# Altium project Mircod_TEST.PrjPCB
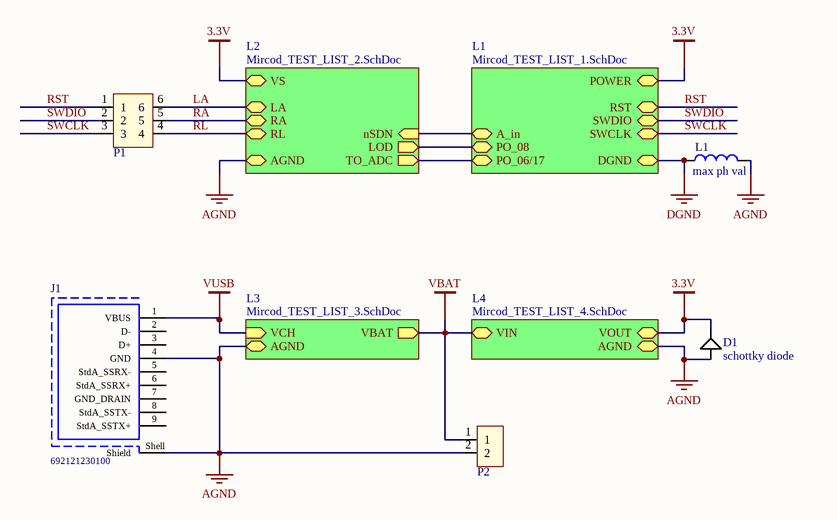
[diagram p0: Mircod_TEST_LIST_MAIN.SchDoc]
5 sheets, 47 parts. Net scope: hierarchical (ports join the sheet entries above them; power ports are global).
Board file: Mircod_TEST.PcbDoc
Sheets:
  Mircod_TEST_LIST_MAIN.SchDoc
    L2 = Mircod_TEST_LIST_2.SchDoc
    L3 = Mircod_TEST_LIST_3.SchDoc
    L1 = Mircod_TEST_LIST_1.SchDoc
    L4 = Mircod_TEST_LIST_4.SchDoc

## Sheet Mircod_TEST_LIST_MAIN.SchDoc
size A4

### Parts
D1  schottky diode  [DSMD_0603]
J1  692121230100  [692121230100]
L1  max ph val  [RDSMD_0603]
P1  PORT  [H_3X2_1_27]  (value not drawn)
P2  Header 1x2  [header-2]  (value not drawn)

### Sub-sheets
L1 = Mircod_TEST_LIST_1.SchDoc: RST, SWDIO, SWCLK, POWER, DGND, A_in, PO_08, PO_06/17
L2 = Mircod_TEST_LIST_2.SchDoc: RA, RL, LA, nSDN (in), LOD (out), TO_ADC (out), VS (bidir), AGND (bidir)
L3 = Mircod_TEST_LIST_3.SchDoc: VBAT (out), VCH (in), AGND
L4 = Mircod_TEST_LIST_4.SchDoc: VOUT, AGND, VIN

### Nets
3.3V: D1.2 ; sheet L2/VS, sheet L1/POWER, sheet L4/VOUT
AGND: D1.1 J1.4(GND) J1.Shell(Shield) L1.1 P2.2 ; sheet L2/AGND, sheet L3/AGND, sheet L4/AGND
DGND: L1.2 ; sheet L1/DGND
VBAT: P2.1 ; sheet L3/VBAT, sheet L4/VIN
VUSB: J1.1(VBUS) ; sheet L3/VCH
LA: P1.6 ; sheet L2/LA
RA: P1.5 ; sheet L2/RA
RL: P1.4 ; sheet L2/RL
RST: P1.1 ; sheet L1/RST
SWCLK: P1.3 ; sheet L1/SWCLK
SWDIO: P1.2 ; sheet L1/SWDIO
NetC7_1: sheet L2/TO_ADC, sheet L1/PO_06/17
NetU1_29: sheet L2/nSDN, sheet L1/A_in
NetU1_32: sheet L2/LOD, sheet L1/PO_08

Not connected (* = marked no-connect by the designer): J1 2(D-) 3(D+) 5(StdA_SSRX-) 6(StdA_SSRX+) 7(GND_DRAIN) 8(StdA_SSTX-) 9(StdA_SSTX+)

### Library data of the parts
D1 = DIODE
J1 = 692121230100: USB 3.0 Type A Receptacle WR-COM, Horizontal, THT, with Clips, with 1.04 mm Offset; Rated Current: 0.25 A; Contact Resistance: 50 mOhm; Working Voltage: 30 VAC; ComponentLink1Description: Manufacturer; ComponentLink1URL: http://www.we-online.de; ComponentLink2Description: Datasheet; ComponentLink2URL: https://katalog.we-online.de/em/datasheet/692121230100.pdf; Part Number: 692121230100; Published Date: September 2018; Publisher: Wurth Elektronik; Orientation: Horizontal; Connector Type: USB 3.0 Type A; Operating Temperature: -20 to 85 degC; Mounting Technology: THT; Gender: Receptacle; Packaging: Tape and Reel
L1 = INDUCTOR

## Sheet Mircod_TEST_LIST_2.SchDoc
size A4
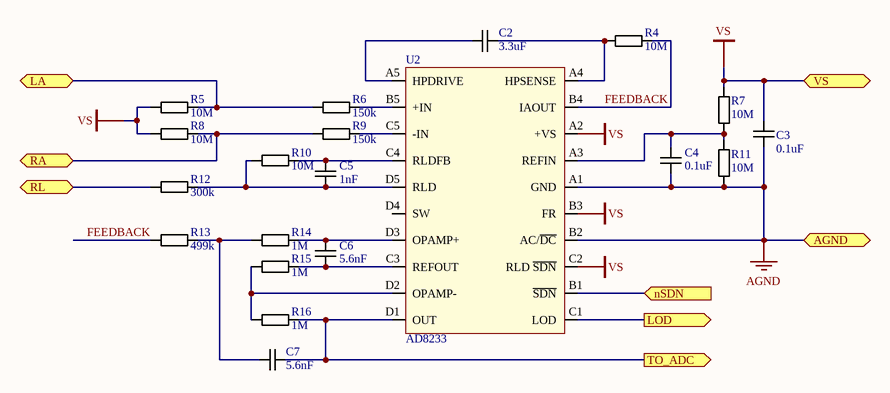
[diagram p1: Mircod_TEST_LIST_2.SchDoc]

### Parts
C2  3.3uF  [Csmd_0402]
C3  0.1uF  [Csmd_0402]
C4  0.1uF  [Csmd_0402]
C5  1nF  [Csmd_0402]
C6  5.6nF  [Csmd_0402]
C7  5.6nF  [Csmd_0402]
R4  10M  [SMD_0402]
R5  10M  [SMD_0402]
R6  150k  [SMD_0402]
R7  10M  [SMD_0402]
R8  10M  [SMD_0402]
R9  150k  [SMD_0402]
R10  10M  [SMD_0402]
R11  10M  [SMD_0402]
R12  300k  [SMD_0402]
R13  499k  [SMD_0402]
R14  1M  [SMD_0402]
R15  1M  [SMD_0402]
R16  1M  [SMD_0402]
U2  AD8233  [CB-20-13]

### Ports
AGND (bidir), LA, LOD (out), nSDN (in), RA, RL, TO_ADC (out), VS (bidir)

### Nets
AGND: C3.1 C4.1 R11.1 U2.A1(GND) U2.B2(AC/~{DC}) ; port AGND
VS: C3.2 R5.1 R7.2 R8.1 U2.A2(+VS) U2.B3(FR) U2.C2(RLD_~{SDN}) ; port VS  [project net 3.3V]
FEEDBACK: R4.2 R13.1 U2.B4(IAOUT)
LA: R5.2 R6.1 ; port LA
RA: R8.2 R9.1 ; port RA
RL: R12.1 ; port RL
NetC2_1: C2.1 U2.A5(HPDRIVE)
NetC2_2: C2.2 R4.1 U2.A4(HPSENSE)
NetC4_2: C4.2 R7.1 R11.2 U2.A3(REFIN)
NetC5_1: C5.1 R10.1 R12.2 U2.D5(RLD)
NetC5_2: C5.2 R10.2 U2.C4(RLDFB)
NetC6_1: C6.1 R15.2 U2.C3(REFOUT)
NetC6_2: C6.2 R14.2 U2.D3(OPAMP+)
NetC7_1: C7.1 R16.2 U2.D1(OUT) ; port TO_ADC
NetC7_2: C7.2 R13.2 R14.1
NetR6_2: R6.2 U2.B5(+IN)
NetR9_2: R9.2 U2.C5(-IN)
NetR15_1: R15.1 R16.1 U2.D2(OPAMP-)
NetU1_29: U2.B1(~{SDN}) ; port nSDN
NetU1_32: U2.C1(LOD) ; port LOD

Not connected (* = marked no-connect by the designer): U2 D4(SW)

### Library data of the parts
C2-C7 = C_SMD: CAPACITOR
R4-R16 = R_SMD: RESISTOR
U2 = AD8233: Low Noise,  Heart Rate Monitor for Wearable Products

## Sheet Mircod_TEST_LIST_3.SchDoc
size A4
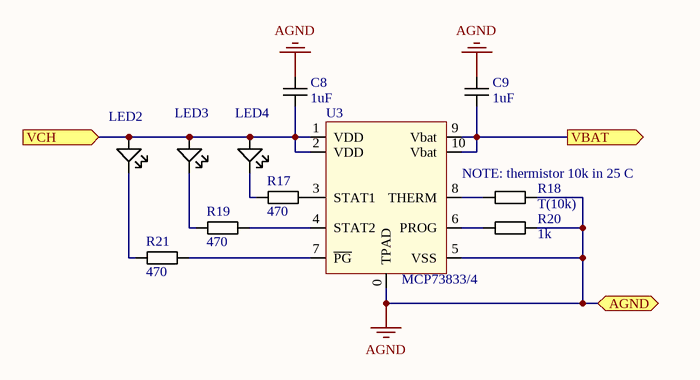
[diagram p2: Mircod_TEST_LIST_3.SchDoc]

### Parts
C8  1uF  [CSMD_0603]
C9  1uF  [CSMD_0603]
LED2  LED  [GDSMD_0603]  (value not drawn)
LED3  LED  [GDSMD_0603]  (value not drawn)
LED4  LED  [BDSMD_0603]  (value not drawn)
R17  470  [SMD_0603]
R18  T(10k)  [SMD_0603]
R19  470  [SMD_0603]
R20  1k  [SMD_0603]
R21  470  [SMD_0603]
U3  MCP73833/4  [10-Lead, 3mm x 3mm DFN]

### Ports
AGND, VBAT (out), VCH (in)

### Nets
AGND: C8.1 C9.1 R18.1 R20.1 U3.0(TPAD) U3.5(VSS) ; port AGND
VBAT: C9.2 U3.9(Vbat) U3.10(Vbat) ; port VBAT
VUSB: C8.2 LED2.1 LED3.1 LED4.1 U3.1(VDD) U3.2(VDD) ; port VCH
NetLED2_2: LED2.2 R21.2
NetLED3_2: LED3.2 R19.2
NetLED4_2: LED4.2 R17.2
NetR17_1: R17.1 U3.3(STAT1)
NetR18_2: R18.2 U3.8(THERM)
NetR19_1: R19.1 U3.4(STAT2)
NetR20_2: R20.2 U3.6(PROG)
NetR21_1: R21.1 U3.7(~{PG})

### Notes on the sheet
- NOTE: thermistor 10k in 25 C

### Library data of the parts
C8 C9 = C_SMD: CAPACITOR
R17-R21 = R_SMD: RESISTOR
U3 = MCP73833/4: Stand-Alone Linear Li-Ion / Li-Polymer Charge  Management Controller

## Sheet Mircod_TEST_LIST_1.SchDoc
size A4
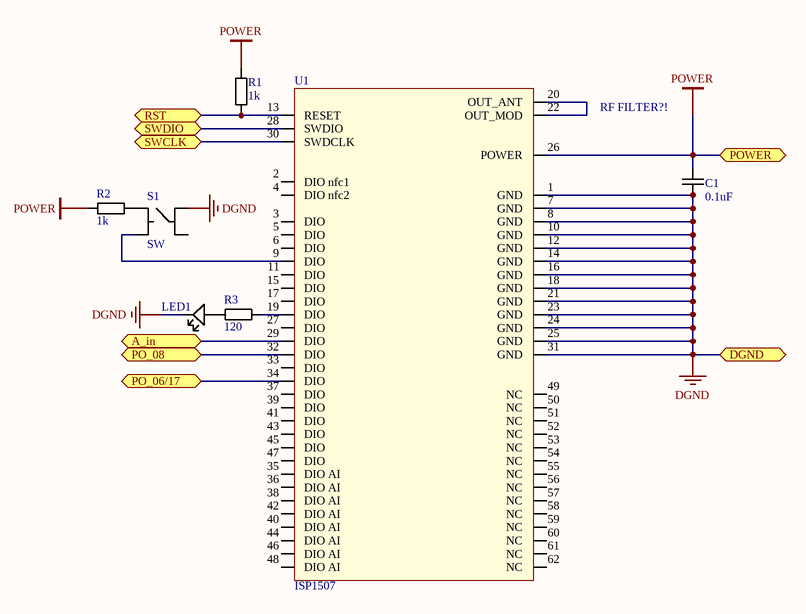
[diagram p3: Mircod_TEST_LIST_1.SchDoc]

### Parts
C1  0.1uF  [Csmd_0402]
LED1  LED  [RDSMD_0603]  (value not drawn)
R1  1k  [SMD_0402]
R2  1k  [SMD_0402]
R3  120  [SMD_0402]
S1  SW  [6x6 Tact Switch]
U1  ISP1507  [LGA62 ISP1507]

### Ports
A_in, DGND, PO_06/17, PO_08, POWER, RST, SWCLK, SWDIO

### Nets
DGND: C1.1 LED1.2 S1.4 U1.1(GND) U1.7(GND) U1.8(GND) U1.10(GND) U1.12(GND) U1.14(GND) U1.16(GND) U1.18(GND) U1.21(GND) U1.23(GND) U1.24(GND) U1.25(GND) U1.31(GND) ; port DGND
POWER: C1.2 R1.2 R2.2 U1.26(POWER) ; port POWER  [project net 3.3V]
RST: R1.1 U1.13(RESET) ; port RST
SWCLK: U1.30(SWDCLK) ; port SWCLK
SWDIO: U1.28(SWDIO) ; port SWDIO
NetC7_1: U1.34(DIO) ; port PO_06/17
NetLED1_1: LED1.1 R3.1
NetR2_1: R2.1 S1.1
NetR3_2: R3.2 U1.19(DIO)
NetS1_2: S1.2 U1.9(DIO)
NetU1_20: U1.20(OUT_ANT) U1.22(OUT_MOD)
NetU1_29: U1.29(DIO) ; port A_in
NetU1_32: U1.32(DIO) ; port PO_08

Not connected (* = marked no-connect by the designer): S1 3; U1 2(DIO_nfc1) 3(DIO) 4(DIO_nfc2) 5(DIO) 6(DIO) 11(DIO) 15(DIO) 17(DIO) 27(DIO) 33(DIO) 35(DIO_AI) 36(DIO_AI) 37(DIO) 38(DIO_AI) 39(DIO) 40(DIO_AI) 41(DIO) 42(DIO_AI) 43(DIO) 44(DIO_AI) 45(DIO) 46(DIO_AI) 47(DIO) 48(DIO_AI) 49(NC) 50(NC) 51(NC) 52(NC) 53(NC) 54(NC) 55(NC) 56(NC) 57(NC) 58(NC) 59(NC) 60(NC) 61(NC) 62(NC)

### Notes on the sheet
- RF FILTER?!

### Library data of the parts
C1 = C_SMD: CAPACITOR
R1-R3 = R_SMD: RESISTOR
S1 = Switch: KLS7-TS6604 6x6 Tact Switch Series
U1 = ISP1507: High Performance Bluetooth 5 Ready, NFC*  & ANT Low Energy Module with MCU & Antenna

## Sheet Mircod_TEST_LIST_4.SchDoc
size A4
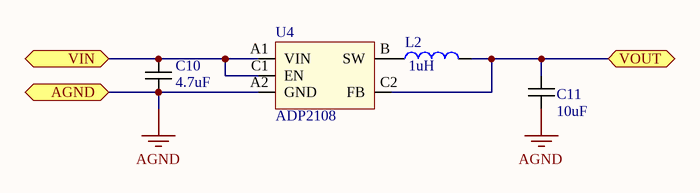
[diagram p4: Mircod_TEST_LIST_4.SchDoc]

### Parts
C10  4.7uF  [CSMD_0603]
C11  10uF  [CSMD_0603]
L2  1uH  [RDSMD_0603]
U4  ADP2108  [CB-5-3]

### Ports
AGND, VIN, VOUT

### Nets
3.3V: C11.2 L2.1 U4.C2(FB) ; port VOUT
AGND: C10.1 C11.1 U4.A2(GND) ; port AGND
VBAT: C10.2 U4.A1(VIN) U4.C1(EN) ; port VIN
NetL2_2: L2.2 U4.B(SW)

### Library data of the parts
C10 C11 = C_SMD: CAPACITOR
L2 = INDUCTOR
U4 = ADP2108: Compact, 600 mA, 3 MHz,  Step-Down DC-to-DC Converter

## Nets that join several sheets
3.3V: Mircod_TEST_LIST_MAIN (D1.2), Mircod_TEST_LIST_2 (7 pins), Mircod_TEST_LIST_1 (C1.2 R1.2 R2.2 U1.26), Mircod_TEST_LIST_4 (C11.2 L2.1 U4.C2)
AGND: Mircod_TEST_LIST_MAIN (5 pins), Mircod_TEST_LIST_2 (5 pins), Mircod_TEST_LIST_3 (6 pins), Mircod_TEST_LIST_4 (C10.1 C11.1 U4.A2)
DGND: Mircod_TEST_LIST_MAIN (L1.2), Mircod_TEST_LIST_1 (16 pins)
VBAT: Mircod_TEST_LIST_MAIN (P2.1), Mircod_TEST_LIST_3 (C9.2 U3.9 U3.10), Mircod_TEST_LIST_4 (C10.2 U4.A1 U4.C1)
VUSB: Mircod_TEST_LIST_MAIN (J1.1), Mircod_TEST_LIST_3 (6 pins)
LA: Mircod_TEST_LIST_MAIN (P1.6), Mircod_TEST_LIST_2 (R5.2 R6.1)
NetC7_1: Mircod_TEST_LIST_2 (C7.1 R16.2 U2.D1), Mircod_TEST_LIST_1 (U1.34)
NetU1_29: Mircod_TEST_LIST_2 (U2.B1), Mircod_TEST_LIST_1 (U1.29)
NetU1_32: Mircod_TEST_LIST_2 (U2.C1), Mircod_TEST_LIST_1 (U1.32)
RA: Mircod_TEST_LIST_MAIN (P1.5), Mircod_TEST_LIST_2 (R8.2 R9.1)
RL: Mircod_TEST_LIST_MAIN (P1.4), Mircod_TEST_LIST_2 (R12.1)
RST: Mircod_TEST_LIST_MAIN (P1.1), Mircod_TEST_LIST_1 (R1.1 U1.13)
SWCLK: Mircod_TEST_LIST_MAIN (P1.3), Mircod_TEST_LIST_1 (U1.30)
SWDIO: Mircod_TEST_LIST_MAIN (P1.2), Mircod_TEST_LIST_1 (U1.28)